# Altium schematic sheet Controller Mainboard.SchDoc
size D; SheetNumber: 1; SheetTotal: 1
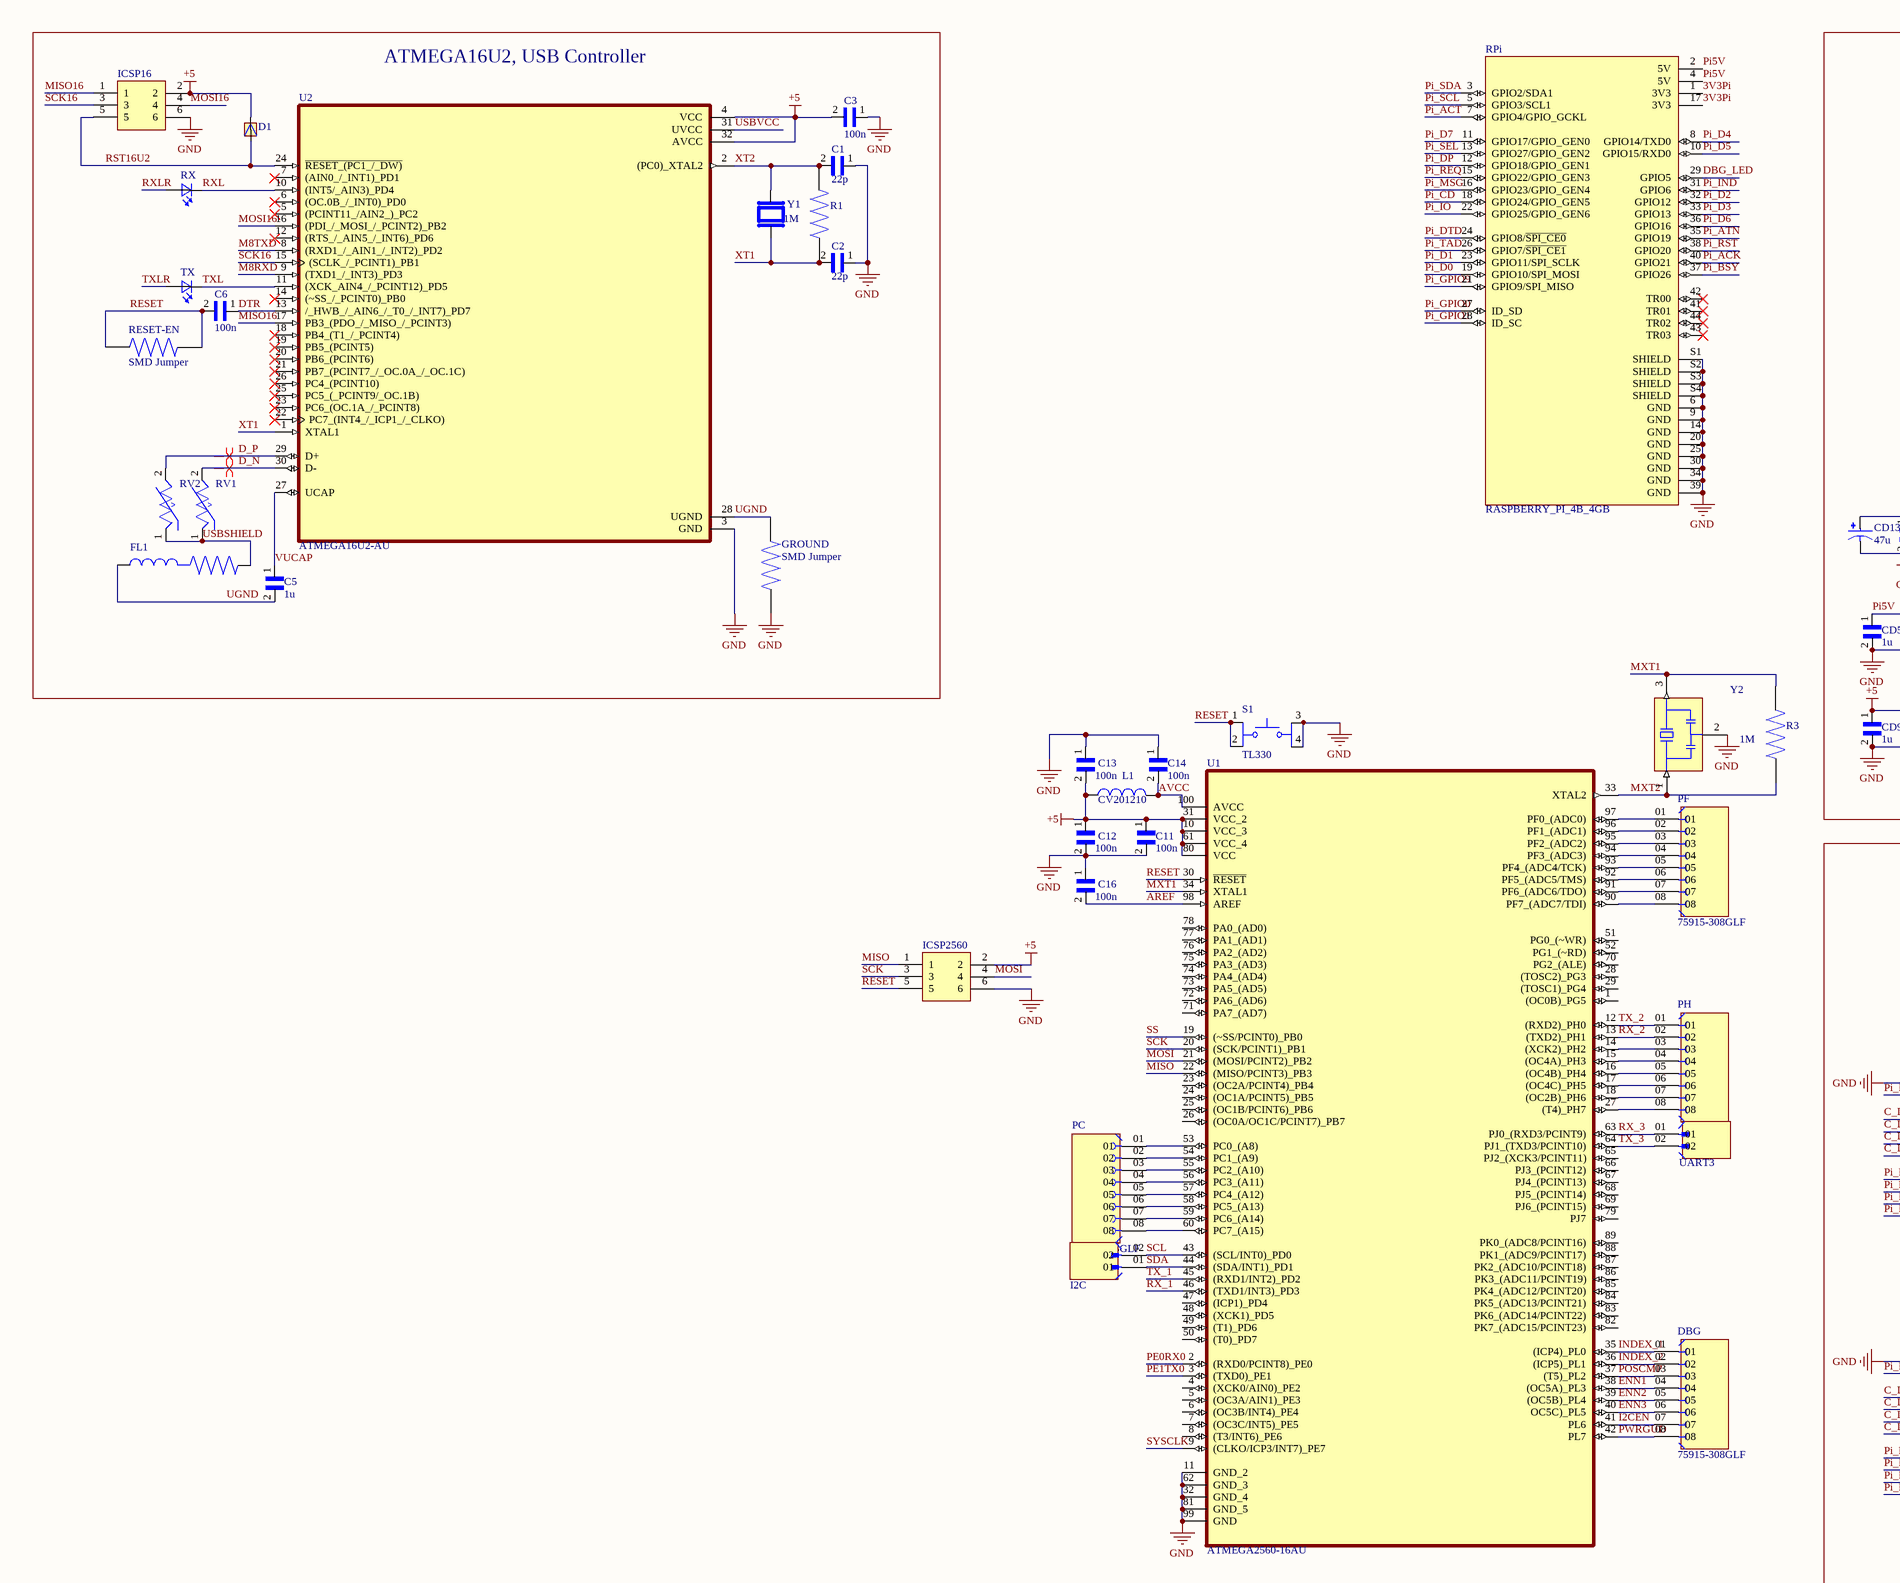
[diagram p0: Controller Mainboard.SchDoc, top left]
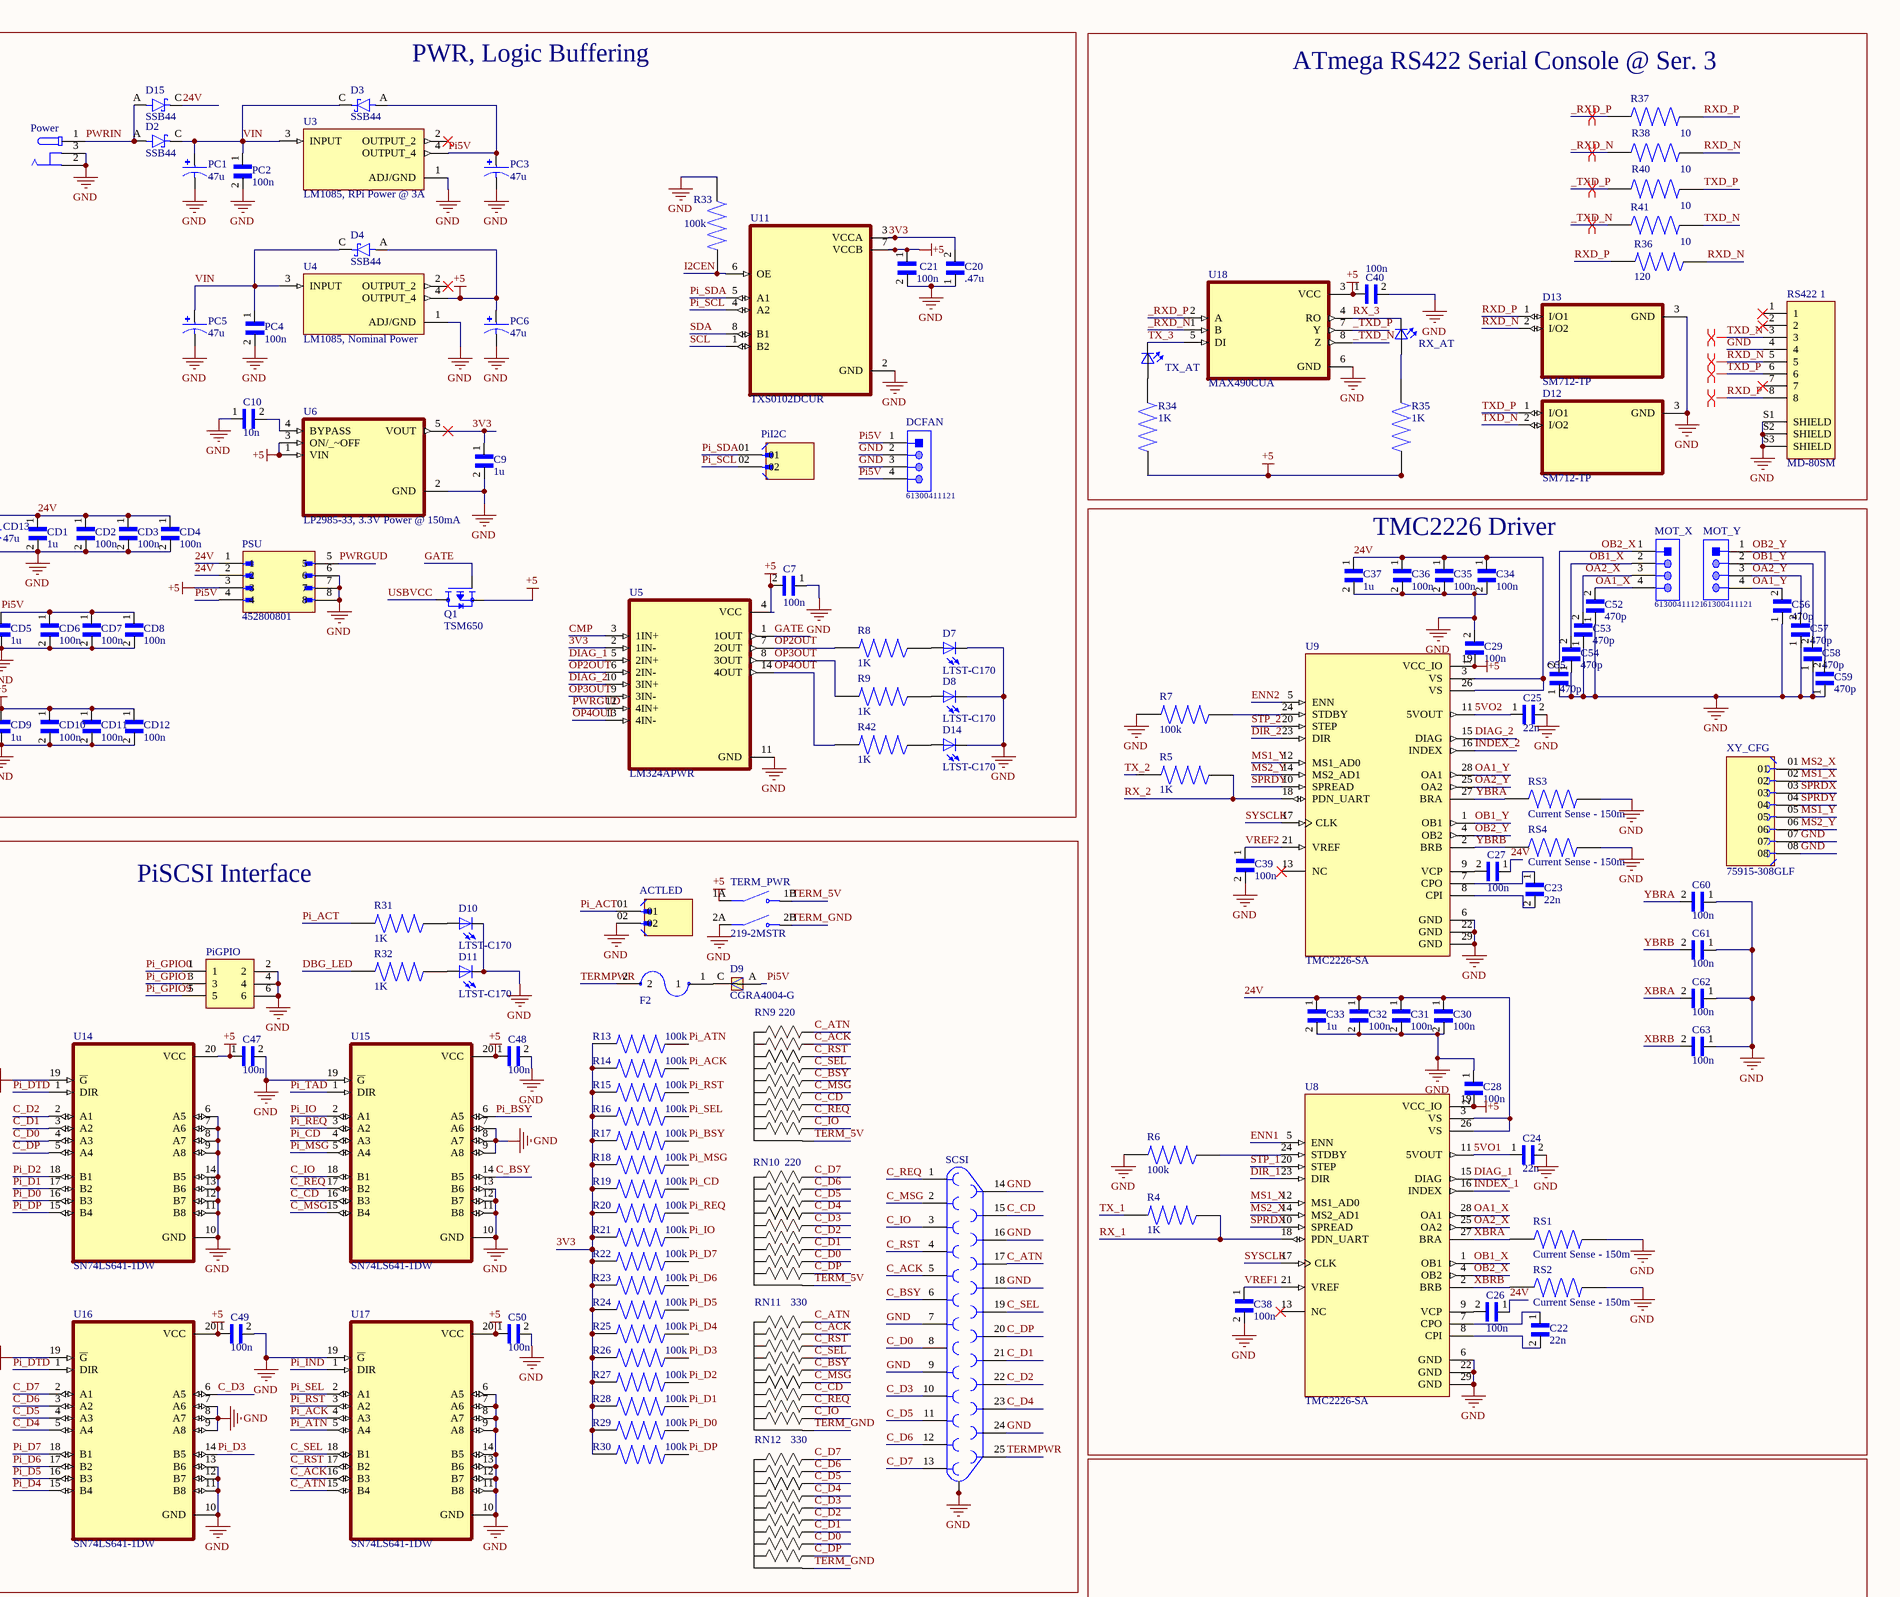
[diagram p1: Controller Mainboard.SchDoc, top right]
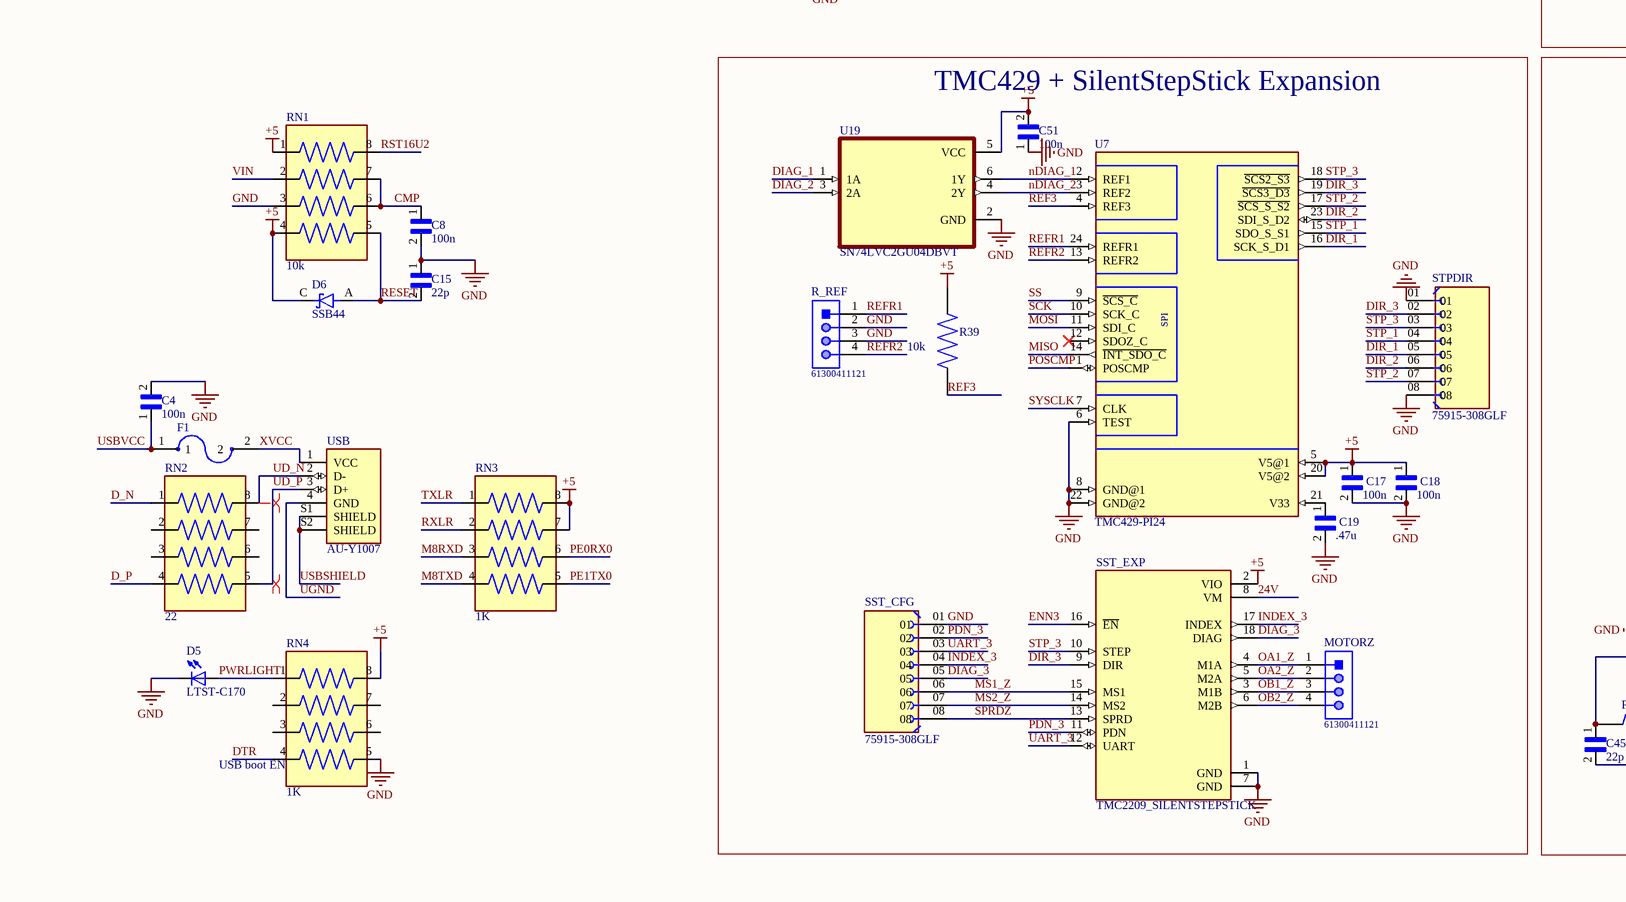
[diagram p2: Controller Mainboard.SchDoc, bottom left]
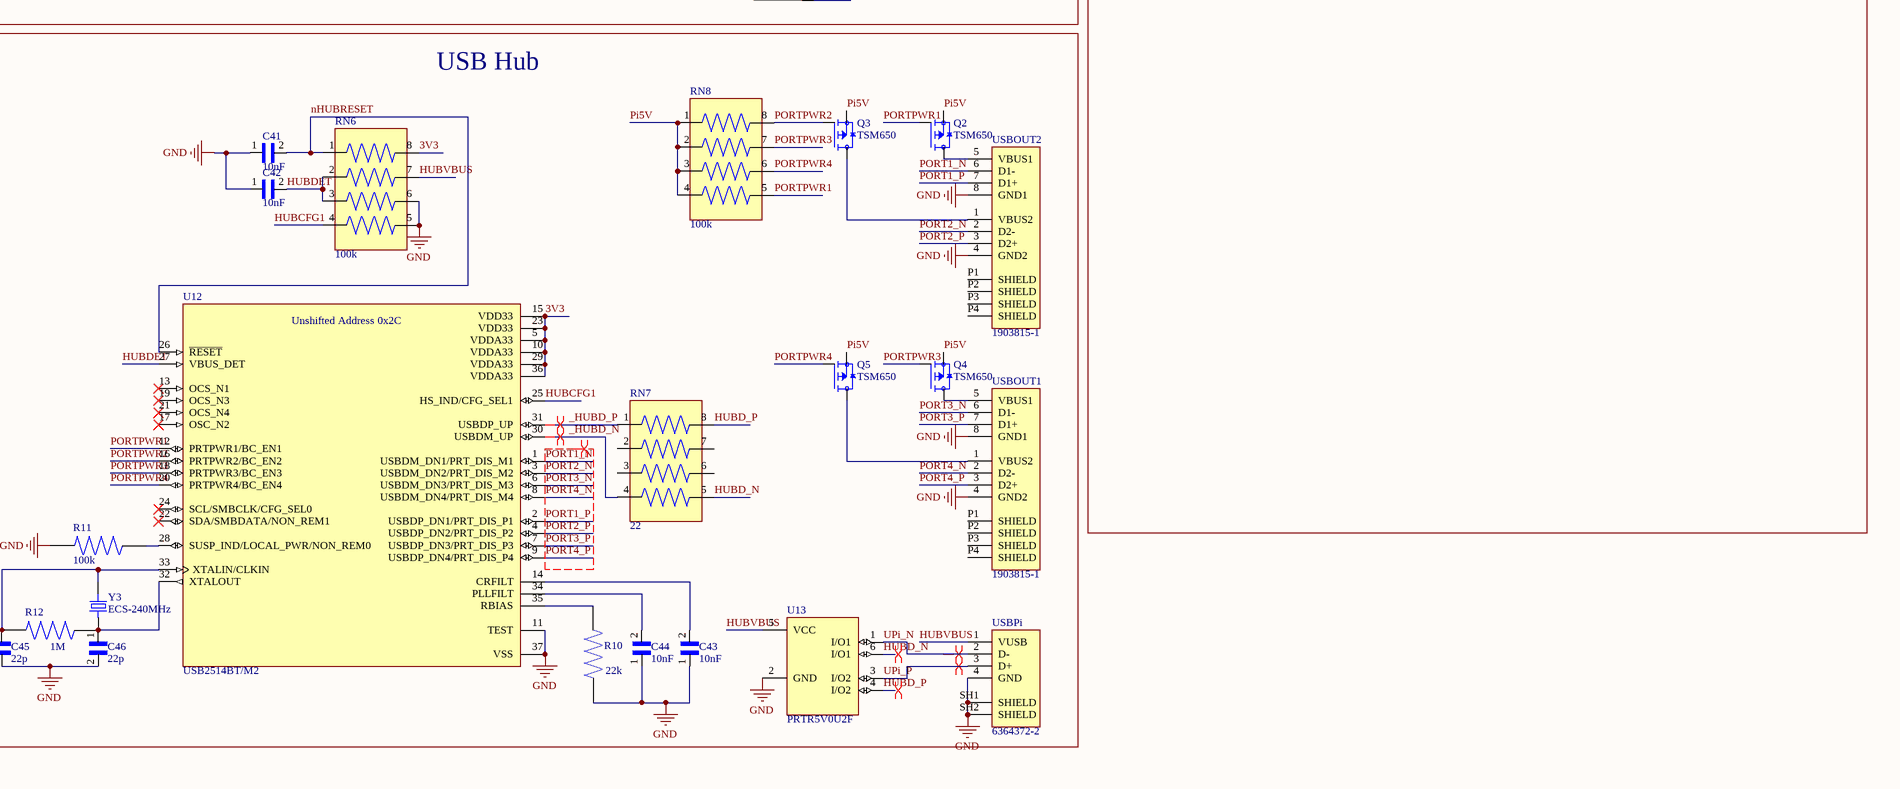
[diagram p3: Controller Mainboard.SchDoc, bottom right]

## Parts
ACTLED  77311-118-02LF  [AMPHENOL_77311-118-02LF]  (value not drawn)
C1  22p  [CAPC1608X90]
C2  22p  [CAPC1608X90]
C3  100n  [CAPC1608X90]
C4  100n  [CAPC1608X90]
C5  1u  [CAPC1608X90]
C6  100n  [CAPC1608X90]
C7  100n  [CAPC1608X90]
C8  100n  [CAPC1608X90]
C9  1u  [CAPC1608X90]
C10  10n  [CAPC1608X90]
C11  100n  [CAPC1608X90]
C12  100n  [CAPC1608X90]
C13  100n  [CAPC1608X90]
C14  100n  [CAPC1608X90]
C15  22p  [CAPC1608X90]
C16  100n  [CAPC1608X90]
C17  100n  [CAPC1608X90]
C18  100n  [CAPC1608X90]
C19  .47u  [CAPC1608X90]
C20  .47u  [CAPC1608X90]
C21  100n  [CAPC1608X90]
C22  22n  [CAPC1608X90]
C23  22n  [CAPC1608X90]
C24  22n  [CAPC1608X90]
C25  22n  [CAPC1608X90]
C26  100n  [CAPC1608X90]
C27  100n  [CAPC1608X90]
C28  100n  [CAPC1608X90]
C29  100n  [CAPC1608X90]
C30  100n  [CAPC1608X90]
C31  100n  [CAPC1608X90]
C32  100n  [CAPC1608X90]
C33  1u  [CAPC1608X90]
C34  100n  [CAPC1608X90]
C35  100n  [CAPC1608X90]
C36  100n  [CAPC1608X90]
C37  1u  [CAPC1608X90]
C38  100n  [CAPC1608X90]
C39  100n  [CAPC1608X90]
C40  100n  [CAPC1608X90]
C41  10nF  [CAPC1608X90]
C42  10nF  [CAPC1608X90]
C43  10nF  [CAPC1608X90]
C44  10nF  [CAPC1608X90]
C45  22p  [CAPC1608X90]
C46  22p  [CAPC1608X90]
C47  100n  [CAPC1608X90]
C48  100n  [CAPC1608X90]
C49  100n  [CAPC1608X90]
C50  100n  [CAPC1608X90]
C51  100n  [CAPC1608X90]
C52  470p  [CAPC1608X90]
C53  470p  [CAPC1608X90]
C54  470p  [CAPC1608X90]
C55  470p  [CAPC1608X90]
C56  470p  [CAPC1608X90]
C57  470p  [CAPC1608X90]
C58  470p  [CAPC1608X90]
C59  470p  [CAPC1608X90]
C60  100n  [CAPC1608X90]
C61  100n  [CAPC1608X90]
C62  100n  [CAPC1608X90]
C63  100n  [CAPC1608X90]
CD1  1u  [CAPC1608X90]
CD2  100n  [CAPC1608X90]
CD3  100n  [CAPC1608X90]
CD4  100n  [CAPC1608X90]
CD5  1u  [CAPC1608X90]
CD6  100n  [CAPC1608X90]
CD7  100n  [CAPC1608X90]
CD8  100n  [CAPC1608X90]
CD9  1u  [CAPC1608X90]
CD10  100n  [CAPC1608X90]
CD11  100n  [CAPC1608X90]
CD12  100n  [CAPC1608X90]
CD13  47u  [CAP_EEHZA1V470P]
D1  CD1206-S01575  [1206(DIODE)]  (value not drawn)
D2  SSB44  [DIOM5336X265N]
D3  SSB44  [DIOM5336X265N]
D4  SSB44  [DIOM5336X265N]
D5  LTST-C170  [DIOC200X125X110]
D6  SSB44  [DIOM5336X265N]
D7  LTST-C170  [DIOC200X125X110]
D8  LTST-C170  [DIOC200X125X110]
D9  CGRA4004-G  [DIOM5127X229N]
D10  LTST-C170  [DIOC200X125X110]
D11  LTST-C170  [DIOC200X125X110]
D12  SM712-TP  [SOT23-3P96_237X112L42X44]
D13  SM712-TP  [SOT23-3P96_237X112L42X44]
D14  LTST-C170  [DIOC200X125X110]
D15  SSB44  [DIOM5336X265N]
DBG  75915-308GLF  [AMPHENOL_75915-308GLF]
DCFAN  61300411121  [61300411121]
F1  MF-MSMF050-2  [FUSM4632X85]  (value not drawn)
F2  MF-MSMF050-2  [FUSM4632X85]  (value not drawn)
FL1  BLM21PG300SN1D  [BEADC2012X105N]  (value not drawn)
GROUND  SMD Jumper  [RESC1608X60N]
I2C  77311-118-02LF  [AMPHENOL_77311-118-02LF]  (value not drawn)
ICSP16  67997-206HLF  [FRAMATOME_67997-206HLF]  (value not drawn)
ICSP2560  67997-206HLF  [FRAMATOME_67997-206HLF]  (value not drawn)
L1  CV201210  [INDC2012X145N]
MOT_X  61300411121  [61300411121]
MOT_Y  61300411121  [61300411121]
MOTORZ  61300411121  [61300411121]
PC  75915-308GLF  [AMPHENOL_75915-308GLF]
PC1  47u  [CAP_EEHZA1V470P]
PC2  100n  [CAPC1608X90]
PC3  47u  [CAP_EEHZA1V470P]
PC4  100n  [CAPC1608X90]
PC5  47u  [CAP_EEHZA1V470P]
PC6  47u  [CAP_EEHZA1V470P]
PF  75915-308GLF  [AMPHENOL_75915-308GLF]
PH  75915-308GLF  [AMPHENOL_75915-308GLF]  (value not drawn)
PiGPIO  67997-206HLF  [FRAMATOME_67997-206HLF]  (value not drawn)
PiI2C  77311-118-02LF  [AMPHENOL_77311-118-02LF]  (value not drawn)
Power  EJ508A  [MPD_EJ508A]  (value not drawn)
PSU  452800801  [MOLEX_452800801]
Q1  TSM650  [TRANS_TSM650P02CX_RFG]
Q2  TSM650  [TRANS_TSM650P02CX_RFG]
Q3  TSM650  [TRANS_TSM650P02CX_RFG]
Q4  TSM650  [TRANS_TSM650P02CX_RFG]
Q5  TSM650  [TRANS_TSM650P02CX_RFG]
R1  1M  [RESC1608X55N]
R3  1M  [RESC1608X55N]
R4  1K  [RESC1608X55N]
R5  1K  [RESC1608X55N]
R6  100k  [RESC1608X55N]
R7  100k  [RESC1608X55N]
R8  1K  [RESC1608X55N]
R9  1K  [RESC1608X55N]
R10  22k  [RESC1608X55N]
R11  100k  [RESC1608X55N]
R12  1M  [RESC1608X55N]
R13  100k  [RESC1608X55N]
R14  100k  [RESC1608X55N]
R15  100k  [RESC1608X55N]
R16  100k  [RESC1608X55N]
R17  100k  [RESC1608X55N]
R18  100k  [RESC1608X55N]
R19  100k  [RESC1608X55N]
R20  100k  [RESC1608X55N]
R21  100k  [RESC1608X55N]
R22  100k  [RESC1608X55N]
R23  100k  [RESC1608X55N]
R24  100k  [RESC1608X55N]
R25  100k  [RESC1608X55N]
R26  100k  [RESC1608X55N]
R27  100k  [RESC1608X55N]
R28  100k  [RESC1608X55N]
R29  100k  [RESC1608X55N]
R30  100k  [RESC1608X55N]
R31  1K  [RESC1608X55N]
R32  1K  [RESC1608X55N]
R33  100k  [RESC1608X55N]
R34  1K  [RESC1608X55N]
R35  1K  [RESC1608X55N]
R36  120  [RESC1608X55N]
R37  10  [RESC1608X55N]
R38  10  [RESC1608X55N]
R39  10k  [RESC1608X55N]
R40  10  [RESC1608X55N]
R41  10  [RESC1608X55N]
R42  1K  [RESC1608X55N]
R_REF  61300411121  [61300411121]
RESET-EN  SMD Jumper  [RESC1608X60N]
RN1  10k  [RESCAF80P320X160X60-8N]
RN2  22  [RESCAF80P320X160X60-8N]
RN3  1K  [RESCAF80P320X160X60-8N]
RN4  1K  [RESCAF80P320X160X60-8N]
RN6  100k  [RESCAF80P320X160X60-8N]
RN7  22  [RESCAF80P320X160X60-8N]
RN8  100k  [RESCAF80P320X160X60-8N]
RN9  220  [10SIP Res Array]
RN10  220  [10SIP Res Array]
RN11  330  [10SIP Res Array]
RN12  330  [10SIP Res Array]
RPi  RASPBERRY_PI_4B_4GB  [MODULE_RASPBERRY_PI_4B_4GB]
RS1  Current Sense - 150m  [RESC6331X70N]
RS2  Current Sense - 150m  [RESC6331X70N]
RS3  Current Sense - 150m  [RESC6331X70N]
RS4  Current Sense - 150m  [RESC6331X70N]
RS422_1  MD-80SM  [CUI_MD-80SM]
RV1  CG0603MLC-05E  [VARC1608X56N]  (value not drawn)
RV2  CG0603MLC-05E  [VARC1608X56N]  (value not drawn)
RX  HSMA-C191  [0603]  (value not drawn)
RX_AT  HSMA-C191  [0603]  (value not drawn)
S1  TL330  [SW_TL3301NF260QG]
SCSI  10090099-S254VLF  [10090099-S254VLF]  (value not drawn)
SST_CFG  75915-308GLF  [AMPHENOL_75915-308GLF]
SST_EXP  TMC2209_SILENTSTEPSTICK  [MODULE_TMC2209_SILENTSTEPSTICK]
STPDIR  75915-308GLF  [AMPHENOL_75915-308GLF]
TERM_PWR  219-2MSTR  [SW_219-2MSTR]
TX  HSMA-C191  [0603]  (value not drawn)
TX_AT  HSMA-C191  [0603]  (value not drawn)
U1  ATMEGA2560-16AU  [QFP50P1600X1600X120-100N]
U2  ATMEGA16U2-AU  [QFP80P900X900X120-32N]
U3  LM1085, RPi Power @ 3A  [TO254P1435X464-4N]
U4  LM1085, Nominal Power  [TO254P1435X464-4N]
U5  LM324APWR  [SOP65P640X120-14N]
U6  LP2985-33, 3.3V Power @ 150mA  [SOT95P280X145-5N]
U7  TMC429-PI24  [SOP24]
U8  TMC2226-SA  [SOP65P640X120-29N]
U9  TMC2226-SA  [SOP65P640X120-29N]
U11  TXS0102DCUR  [SOP50P310X90-8N]
U12  USB2514BT/M2  [QFN50P600X600X100-37N]
U13  PRTR5V0U2F  [PSON50P145X100X90-6N]
U14  SN74LS641-1DW  [SOIC127P1030X265-20N]
U15  SN74LS641-1DW  [SOIC127P1030X265-20N]
U16  SN74LS641-1DW  [SOIC127P1030X265-20N]
U17  SN74LS641-1DW  [SOIC127P1030X265-20N]
U18  MAX490CUA  [SOP65P490X110-8N]
U19  SN74LVC2GU04DBVT  [SOT95P280X145-6N]
UART3  77311-118-02LF  [AMPHENOL_77311-118-02LF]  (value not drawn)
USB  AU-Y1007  [ASSMANN_AU-Y1007]
USBOUT1  1903815-1  [TE_1903815-1]
USBOUT2  1903815-1  [TE_1903815-1]
USBPi  6364372-2  [TE_6364372-2]
XY_CFG  75915-308GLF  [AMPHENOL_75915-308GLF]
Y1  ABLS-16.000MHZ-20-B-4-Y-T  [XTAL_ABLS-16.000MHZ-20-B-4-Y-T]  (value not drawn)
Y2  CSTNE16M0V530000R0  [OSC_CSTNE16M0V530000R0]  (value not drawn)
Y3  ECS-240MHz  [XTAL_ECS-240-18-5PXEN-TR]

## Blocks framed on the sheet
ATMEGA16U2, USB Controller: C1-C3 C5 C6 D1 FL1 GROUND ICSP16 R1 RESET-EN RV1 RV2 RX TX U2 Y1
PWR, Logic Buffering: C7 C9 C10 C20 C21 CD1-CD13 D2-D4 D7 D8 D14 D15 DCFAN PC1-PC6 PiI2C Power PSU Q1 R8 R9 R33 R42 U3-U6 U11
ATmega RS422 Serial Console @ Ser. 3: C40 D12 D13 R34-R38 R40 R41 RS422_1 RX_AT TX_AT U18
TMC2226 Driver: C22-C39 C52-C63 MOT_X MOT_Y R4-R7 RS1-RS4 U8 U9 XY_CFG
PiSCSI Interface: ACTLED C47-C50 D9-D11 F2 PiGPIO R13-R32 RN9-RN12 SCSI TERM_PWR U14-U17
TMC429 + SilentStepStick Expansion: C17-C19 C51 MOTORZ R39 R_REF SST_CFG SST_EXP STPDIR U7 U19
USB Hub: C41-C46 Q2-Q5 R10-R12 RN6-RN8 U12 U13 USBOUT1 USBOUT2 USBPi Y3

## Nets
+5: C3.2 C7.2 C11.1 C12.1 C13.2 C17.1 C18.1 C21.1 C28.2 C29.1 C40.1 C47.1 C48.1 C49.1 C50.1 C51.2 CD9.1 CD10.1 CD11.1 CD12.1 D1.C D4.A D6.C(K) ICSP16.2 ICSP2560.2 L1.1 PC6.1 PSU.3 Q1.2(S) R34.2 R35.2 R39.2 RN1.1 RN1.4 RN3.7 RN3.8 RN4.8 SST_EXP.2(VIO) TERM_PWR.1A(COM1) U1.10(VCC_3) U1.31(VCC_2) U1.61(VCC_4) U1.80(VCC) U2.4(VCC) U2.32(AVCC) U4.4(OUTPUT_4) U5.4(VCC) U6.1(VIN) U6.3(ON/_~OFF) U7.5(V5@1) U7.20(V5@2) U8.19(VCC_IO) U9.19(VCC_IO) U11.7(VCCB) U14.20(VCC) U15.20(VCC) U16.20(VCC) U17.20(VCC) U18.3(VCC) U19.5(VCC)
GND: ACTLED.02 C1.1 C2.1 C3.1 C4.2 C7.1 C8.2 C9.2 C10.1 C11.2 C12.2 C13.1 C14.1 C15.1 C16.1 C17.2 C18.2 C19.2 C20.1 C21.2 C24.2 C25.2 C28.1 C29.2 C30.2 C31.2 C32.2 C33.2 C34.2 C35.2 C36.2 C37.2 C38.2 C39.2 C40.2 C41.1 C42.1 C43.1 C44.1 C45.2 C46.2 C47.2 C48.2 C49.2 C50.2 C51.1 C52.1 C53.1 C54.1 C55.1 C56.1 C57.1 C58.1 C59.1 C60.1 C61.1 C62.1 C63.1 CD1.2 CD2.2 CD3.2 CD4.2 CD5.2 CD6.2 CD7.2 CD8.2 CD9.2 CD10.2 CD11.2 CD12.2 CD13.2 D5.NEG D7.NEG D8.NEG D10.NEG D11.NEG D12.3(GND) D13.3(GND) D14.NEG DCFAN.2 DCFAN.3 GROUND.2 ICSP16.6 ICSP2560.6 PC1.2 PC2.2 PC3.2 PC4.2 PC5.2 PC6.2 PiGPIO.2 PiGPIO.4 PiGPIO.6 Power.2 Power.3 PSU.6 PSU.7 PSU.8 R6.2 R7.2 R10.1 R11.2 R33.1 R_REF.2 R_REF.3 RN1.3 RN4.5 RN6.5 RN6.6 RPi.6(GND) RPi.9(GND) RPi.14(GND) RPi.20(GND) RPi.25(GND) RPi.30(GND) RPi.34(GND) RPi.39(GND) RPi.S1(SHIELD) RPi.S2(SHIELD) RPi.S3(SHIELD) RPi.S4(SHIELD) RS1.2 RS2.2 RS3.2 RS4.2 RS422_1.4 RS422_1.S1(SHIELD) RS422_1.S2(SHIELD) RS422_1.S3(SHIELD) S1.3 S1.4 SCSI.7 SCSI.9 SCSI.14 SCSI.16 SCSI.18 SCSI.24 SCSI.GND@1(GND) SCSI.GND@2(GND) SST_CFG.01 SST_EXP.1(GND) SST_EXP.7(GND) STPDIR.01 STPDIR.08 TERM_PWR.2A(COM2) U1.11(GND_2) U1.32(GND_4) U1.62(GND_3) U1.81(GND_5) U1.99(GND) U2.3(GND) U3.1(ADJ/GND) U4.1(ADJ/GND) U5.11(GND) U6.2(GND) U7.6(TEST) U7.8(GND@1) U7.22(GND@2) U8.6(GND) U8.22(GND) U8.29(GND) U9.6(GND) U9.22(GND) U9.29(GND) U11.2(GND) U12.11(TEST) U12.37(VSS) U13.2(GND) U14.6(A5) U14.7(A6) U14.8(A7) U14.9(A8) U14.10(GND) U14.11(B8) U14.12(B7) U14.13(B6) U14.14(B5) U14.19(~{G}) U15.7(A6) U15.8(A7) U15.9(A8) U15.10(GND) U15.11(B8) U15.12(B7) U15.13(B6) U15.19(~{G}) U16.7(A6) U16.8(A7) U16.9(A8) U16.10(GND) U16.11(B8) U16.12(B7) U16.13(B6) U16.19(~{G}) U17.6(A5) U17.7(A6) U17.8(A7) U17.9(A8) U17.10(GND) U17.11(B8) U17.12(B7) U17.13(B6) U17.14(B5) U17.19(~{G}) U18.6(GND) U19.2(GND) USBOUT1.4(GND2) USBOUT1.8(GND1) USBOUT2.4(GND2) USBOUT2.8(GND1) USBPi.4(GND) USBPi.SH1(SHIELD) USBPi.SH2(SHIELD) XY_CFG.07 XY_CFG.08 Y2.2(GND)
3V3: C9.1 C20.2 R13.2 R14.2 R15.2 R16.2 R17.2 R18.2 R19.2 R20.2 R21.2 R22.2 R23.2 R24.2 R25.2 R26.2 R27.2 R28.2 R29.2 R30.2 RN6.8 U5.2(1IN-) U6.5(VOUT) U11.3(VCCA) U12.5(VDDA33) U12.10(VDDA33) U12.15(VDD33) U12.23(VDD33) U12.29(VDDA33) U12.36(VDDA33)
3V3Pi: RPi.1(3V3) RPi.17(3V3)
5VO1: C24.1 U8.11(5VOUT)
5VO2: C25.1 U9.11(5VOUT)
24V: C26.1 C27.1 C30.1 C31.1 C32.1 C33.1 C34.1 C35.1 C36.1 C37.1 CD1.1 CD2.1 CD3.1 CD4.1 CD13.1 D15.C(K) PSU.1 PSU.2 SST_EXP.8(VM) U8.3(VS) U8.26(VS) U9.3(VS) U9.26(VS)
_HUBD_N: RN7.4 U12.30(USBDM_UP)
_HUBD_P: RN7.1 U12.31(USBDP_UP)
_RXD_N: R38.1 U18.1(B)
_RXD_P: R37.1 U18.2(A)
_TXD_N: R41.1 U18.8(Z)
_TXD_P: R40.1 U18.7(Y)
AREF: C16.2 U1.98(AREF)
AVCC: C14.2 L1.2 U1.100(AVCC)
C_ACK: RN9.9 RN11.9 SCSI.5 U17.16(B3)
C_ATN: RN9.10 RN11.10 SCSI.17 U17.15(B4)
C_BSY: RN9.6 RN11.6 SCSI.6 U15.14(B5)
C_CD: RN9.4 RN11.4 SCSI.15 U15.16(B3)
C_D0: RN10.3 RN12.3 SCSI.8 U14.4(A3)
C_D1: RN10.4 RN12.4 SCSI.21 U14.3(A2)
C_D2: RN10.5 RN12.5 SCSI.22 U14.2(A1)
C_D3: RN10.6 RN12.6 SCSI.10 U16.6(A5)
C_D4: RN10.7 RN12.7 SCSI.23 U16.5(A4)
C_D5: RN10.8 RN12.8 SCSI.11 U16.4(A3)
C_D6: RN10.9 RN12.9 SCSI.12 U16.3(A2)
C_D7: RN10.10 RN12.10 SCSI.13 U16.2(A1)
C_DP: RN10.2 RN12.2 SCSI.20 U14.5(A4)
C_IO: RN9.2 RN11.2 SCSI.3 U15.18(B1)
C_MSG: RN9.5 RN11.5 SCSI.2 U15.15(B4)
C_REQ: RN9.3 RN11.3 SCSI.1 U15.17(B2)
C_RST: RN9.8 RN11.8 SCSI.4 U17.17(B2)
C_SEL: RN9.7 RN11.7 SCSI.19 U17.18(B1)
CMP: C8.1 RN1.6 RN1.7 U5.3(1IN+)
D_N: RN2.1 RV1.2 U2.30(D-)
D_P: RN2.4 RV2.2 U2.29(D+)
DBG_LED: R32.2 RPi.29(GPIO5)
DIAG_1: U5.5(2IN+) U8.15(DIAG) U19.1(1A)
DIAG_2: U5.10(3IN+) U9.15(DIAG) U19.3(2A)
DIAG_3: SST_CFG.05 SST_EXP.18(DIAG)
DIR_1: STPDIR.05 U7.16(SCK_S_D1) U8.23(DIR)
DIR_2: STPDIR.06 U7.23(SDI_S_D2) U9.23(DIR)
DIR_3: SST_EXP.9(DIR) STPDIR.02 U7.19(~{SCS3_D3})
DTR: C6.1 RN4.4 U2.13(/_HWB_/_AIN6_/_T0_/_INT7)_PD7)
ENN1: DBG.04 U1.38((OC5A)_PL3) U8.5(ENN)
ENN2: DBG.05 U1.39((OC5B)_PL4) U9.5(ENN)
ENN3: DBG.06 SST_EXP.16(~{EN}) U1.40(OC5C)_PL5)
GATE: Q1.1(G) U5.1(1OUT)
HUBCFG1: RN6.4 U12.25(HS_IND/CFG_SEL1)
HUBD_N: RN7.5 U13.6(I/O1)
HUBD_P: RN7.8 U13.4(I/O2)
HUBDET: C42.2 RN6.2 RN6.3 U12.27(VBUS_DET)
HUBVBUS: RN6.7 U13.5(VCC) USBPi.1(VUSB)
I2CEN: DBG.07 R33.2 U1.41(PL6) U11.6(OE)
INDEX_1: DBG.01 U1.35((ICP4)_PL0) U8.16(INDEX)
INDEX_2: DBG.02 U1.36((ICP5)_PL1) U9.16(INDEX)
INDEX_3: SST_CFG.04 SST_EXP.17(INDEX)
M8RXD: RN3.3 U2.9((TXD1_/_INT3)_PD3)
M8TXD: RN3.4 U2.8((RXD1_/_AIN1_/_INT2)_PD2)
MISO: ICSP2560.1 U1.22((MISO/PCINT3)_PB3) U7.14(~{INT_SDO_C})
MISO16: ICSP16.1 U2.17(PB3_(PDO_/_MISO_/_PCINT3))
MOSI: ICSP2560.4 U1.21((MOSI/PCINT2)_PB2) U7.11(SDI_C)
MOSI16: ICSP16.4 U2.16((PDI_/_MOSI_/_PCINT2)_PB2)
MS1_X: U8.12(MS1_AD0) XY_CFG.02
MS1_Y: U9.12(MS1_AD0) XY_CFG.05
MS1_Z: SST_CFG.06 SST_EXP.15(MS1)
MS2_X: U8.14(MS2_AD1) XY_CFG.01
MS2_Y: U9.14(MS2_AD1) XY_CFG.06
MS2_Z: SST_CFG.07 SST_EXP.14(MS2)
MXT1: R3.2 U1.34(XTAL1) Y2.3(OUT)
MXT2: R3.1 U1.33(XTAL2) Y2.1(IN)
nDIAG_1: U7.2(REF1) U19.6(1Y)
nDIAG_2: U7.3(REF2) U19.4(2Y)
nHUBRESET: C41.2 RN6.1 U12.26(~{RESET})
OA1_X: C52.2 MOT_X.4 U8.28(OA1)
OA1_Y: C56.2 MOT_Y.4 U9.28(OA1)
OA1_Z: MOTORZ.1 SST_EXP.4(M1A)
OA2_X: C53.2 MOT_X.3 U8.25(OA2)
OA2_Y: C57.2 MOT_Y.3 U9.25(OA2)
OA2_Z: MOTORZ.2 SST_EXP.5(M2A)
OB1_X: C54.2 MOT_X.2 U8.1(OB1)
OB1_Y: C58.2 MOT_Y.2 U9.1(OB1)
OB1_Z: MOTORZ.3 SST_EXP.3(M1B)
OB2_X: C55.2 MOT_X.1 U8.4(OB2)
OB2_Y: C59.2 MOT_Y.1 U9.4(OB2)
OB2_Z: MOTORZ.4 SST_EXP.6(M2B)
OP2OUT: R8.2 U5.6(2IN-) U5.7(2OUT)
OP3OUT: R9.2 U5.8(3OUT) U5.9(3IN-)
OP4OUT: R42.2 U5.13(4IN-) U5.14(4OUT)
PDN_3: SST_CFG.02 SST_EXP.11(PDN)
PE0RX0: RN3.6 U1.2((RXD0/PCINT8)_PE0)
PE1TX0: RN3.5 U1.3((TXD0)_PE1)
Pi5V: CD5.1 CD6.1 CD7.1 CD8.1 D3.A D9.A DCFAN.1 DCFAN.4 PC3.1 PSU.4 Q2.2(S) Q3.2(S) Q4.2(S) Q5.2(S) RN8.1 RN8.2 RN8.3 RN8.4 RPi.2(5V) RPi.4(5V) U3.4(OUTPUT_4)
Pi_ACK: R14.1 RPi.40(GPIO21) U17.4(A3)
Pi_ACT: ACTLED.01 R31.2 RPi.7(GPIO4/GPIO_GCKL)
Pi_ATN: R13.1 RPi.35(GPIO19) U17.5(A4)
Pi_BSY: R17.1 RPi.37(GPIO26) U15.6(A5)
Pi_CD: R19.1 RPi.18(GPIO24/GPIO_GEN5) U15.4(A3)
Pi_D0: R29.1 RPi.19(GPIO10/SPI_MOSI) U14.16(B3)
Pi_D1: R28.1 RPi.23(GPIO11/SPI_SCLK) U14.17(B2)
Pi_D2: R27.1 RPi.32(GPIO12) U14.18(B1)
Pi_D3: R26.1 RPi.33(GPIO13) U16.14(B5)
Pi_D4: R25.1 RPi.8(GPIO14/TXD0) U16.15(B4)
Pi_D5: R24.1 RPi.10(GPIO15/RXD0) U16.16(B3)
Pi_D6: R23.1 RPi.36(GPIO16) U16.17(B2)
Pi_D7: R22.1 RPi.11(GPIO17/GPIO_GEN0) U16.18(B1)
Pi_DP: R30.1 RPi.12(GPIO18/GPIO_GEN1) U14.15(B4)
Pi_DTD: RPi.24(GPIO8/~{SPI_CE0}) U14.1(DIR) U16.1(DIR)
Pi_GPIO0: PiGPIO.1 RPi.27(ID_SD)
Pi_GPIO1: PiGPIO.3 RPi.28(ID_SC)
Pi_GPIO9: PiGPIO.5 RPi.21(GPIO9/SPI_MISO)
Pi_IND: RPi.31(GPIO6) U17.1(DIR)
Pi_IO: R21.1 RPi.22(GPIO25/GPIO_GEN6) U15.2(A1)
Pi_MSG: R18.1 RPi.16(GPIO23/GPIO_GEN4) U15.5(A4)
Pi_REQ: R20.1 RPi.15(GPIO22/GPIO_GEN3) U15.3(A2)
Pi_RST: R15.1 RPi.38(GPIO20) U17.3(A2)
Pi_SCL: PiI2C.02 RPi.5(GPIO3/SCL1) U11.4(A2)
Pi_SDA: PiI2C.01 RPi.3(GPIO2/SDA1) U11.5(A1)
Pi_SEL: R16.1 RPi.13(GPIO27/GPIO_GEN2) U17.2(A1)
Pi_TAD: RPi.26(GPIO7/~{SPI_CE1}) U15.1(DIR)
PORT1_N: U12.1(USBDM_DN1/PRT_DIS_M1) USBOUT2.6(D1-)
PORT1_P: U12.2(USBDP_DN1/PRT_DIS_P1) USBOUT2.7(D1+)
PORT2_N: U12.3(USBDM_DN2/PRT_DIS_M2) USBOUT2.2(D2-)
PORT2_P: U12.4(USBDP_DN2/PRT_DIS_P2) USBOUT2.3(D2+)
PORT3_N: U12.6(USBDM_DN3/PRT_DIS_M3) USBOUT1.6(D1-)
PORT3_P: U12.7(USBDP_DN3/PRT_DIS_P3) USBOUT1.7(D1+)
PORT4_N: U12.8(USBDM_DN4/PRT_DIS_M4) USBOUT1.2(D2-)
PORT4_P: U12.9(USBDP_DN4/PRT_DIS_P4) USBOUT1.3(D2+)
PORTPWR1: Q2.1(G) RN8.5 U12.12(PRTPWR1/BC_EN1)
PORTPWR2: Q3.1(G) RN8.8 U12.16(PRTPWR2/BC_EN2)
PORTPWR3: Q4.1(G) RN8.7 U12.18(PRTPWR3/BC_EN3)
PORTPWR4: Q5.1(G) RN8.6 U12.20(PRTPWR4/BC_EN4)
POSCMP: DBG.03 U1.37((T5)_PL2) U7.1(POSCMP)
PWRGUD: DBG.08 PSU.5 U1.42(PL7) U5.12(4IN+)
PWRIN: D2.A D15.A Power.1
PWRLIGHT: D5.POS RN4.1
REF3: R39.1 U7.4(REF3)
REFR1: R_REF.1 U7.24(REFR1)
REFR2: R_REF.4 U7.13(REFR2)
RESET: C6.2 C15.2 D6.A ICSP2560.5 RESET-EN.1 RESET-EN.2 RN1.5 S1.1 S1.2 U1.30(~{RESET})
RST16U2: D1.A ICSP16.5 RN1.8 U2.24(~{RESET_(PC1_/_DW)})
RX_1: R4.1 U1.46((TXD1/INT3)_PD3) U8.18(PDN_UART)
RX_2: PH.02 R5.1 U1.13((TXD2)_PH1) U9.18(PDN_UART)
RX_3: RX_AT.1(K2) U1.63(PJ0_(RXD3/PCINT9)) U18.4(RO) UART3.01
RXD_N: D13.2(I/O2) R36.1 R38.2 RS422_1.5
RXD_P: D13.1(I/O1) R36.2 R37.2 RS422_1.8
RXL: RX.1(K2) U2.10((INT5/_AIN3)_PD4)
RXLR: RN3.2 RX.2(A2)
SCK: ICSP2560.3 U1.20((SCK/PCINT1)_PB1) U7.10(SCK_C)
SCK16: ICSP16.3 U2.15((SCLK_/_PCINT1)_PB1)
SCL: I2C.02 U1.43((SCL/INT0)_PD0) U11.1(B2)
SDA: I2C.01 U1.44((SDA/INT1)_PD1) U11.8(B1)
SPRDX: U8.10(SPREAD) XY_CFG.03
SPRDY: U9.10(SPREAD) XY_CFG.04
SPRDZ: SST_CFG.08 SST_EXP.13(SPRD)
SS: U1.19((~SS/PCINT0)_PB0) U7.9(~{SCS_C})
STP_1: STPDIR.04 U7.15(SDO_S_S1) U8.20(STEP)
STP_2: STPDIR.07 U7.17(~{SCS_S_S2}) U9.20(STEP)
STP_3: SST_EXP.10(STEP) STPDIR.03 U7.18(~{SCS2_S3})
SYSCLK: U1.9((CLKO/ICP3/INT7)_PE7) U7.7(CLK) U8.17(CLK) U9.17(CLK)
TERM_5V: RN9.1 RN10.1 TERM_PWR.1B(NO1)
TERM_GND: RN11.1 RN12.1 TERM_PWR.2B(NO2)
TERMPWR: F2.2 SCSI.25
TX_1: R4.2 U1.45((RXD1/INT2)_PD2)
TX_2: PH.01 R5.2 U1.12((RXD2)_PH0)
TX_3: TX_AT.1(K2) U1.64(PJ1_(TXD3/PCINT10)) U18.5(DI) UART3.02
TXD_N: D12.2(I/O2) R41.2 RS422_1.3
TXD_P: D12.1(I/O1) R40.2 RS422_1.6
TXL: TX.1(K2) U2.11((XCK_AIN4_/_PCINT12)_PD5)
TXLR: RN3.1 TX.2(A2)
UART_3: SST_CFG.03 SST_EXP.12(UART)
UD_N: RN2.8 USB.2(D-)
UD_P: RN2.5 USB.3(D+)
UGND: C5.2 FL1.1 GROUND.1 U2.28(UGND) USB.4(GND)
UPi_N: U13.1(I/O1) USBPi.2(D-)
UPi_P: U13.3(I/O2) USBPi.3(D+)
USBSHIELD: FL1.2 RV1.1 RV2.1 USB.S1(SHIELD) USB.S2(SHIELD)
USBVCC: C4.1 F1.1 Q1.3(D) U2.31(UVCC)
VIN: D2.C(K) D3.C(K) D4.C(K) PC1.1 PC2.1 PC4.1 PC5.1 RN1.2 U3.3(INPUT) U4.3(INPUT)
VREF1: C38.1 U8.21(VREF)
VREF2: C39.1 U9.21(VREF)
VUCAP: C5.1 U2.27(UCAP)
XBRA: C62.2 RS1.1 U8.27(BRA)
XBRB: C63.2 RS2.1 U8.2(BRB)
XT1: C2.2 R1.1 U2.1(XTAL1) Y1.1
XT2: C1.2 R1.2 U2.2((PC0)_XTAL2) Y1.2
XVCC: F1.2 USB.1(VCC)
YBRA: C60.2 RS3.1 U9.27(BRA)
YBRB: C61.2 RS4.1 U9.2(BRB)
NetC10_2: C10.2 U6.4(BYPASS)
NetC19_1: C19.1 U7.21(V33)
NetC22_1: C22.1 U8.7(CPO)
NetC22_2: C22.2 U8.8(CPI)
NetC23_1: C23.1 U9.7(CPO)
NetC23_2: C23.2 U9.8(CPI)
NetC26_2: C26.2 U8.9(VCP)
NetC27_2: C27.2 U9.9(VCP)
NetC43_2: C43.2 U12.14(CRFILT)
NetC44_2: C44.2 U12.34(PLLFILT)
NetC45_1: C45.1 R12.2 U12.33(XTALIN/CLKIN) Y3.2
NetC46_1: C46.1 R12.1 U12.32(XTALOUT) Y3.1
NetD7_POS: D7.POS R8.1
NetD8_POS: D8.POS R9.1
NetD9_C: D9.C F2.1
NetD10_POS: D10.POS R31.1
NetD11_POS: D11.POS R32.1
NetD14_POS: D14.POS R42.1
NetPC_01: PC.01 U1.53(PC0_(A8))
NetPC_02: PC.02 U1.54(PC1_(A9))
NetPC_03: PC.03 U1.55(PC2_(A10))
NetPC_04: PC.04 U1.56(PC3_(A11))
NetPC_05: PC.05 U1.57(PC4_(A12))
NetPC_06: PC.06 U1.58(PC5_(A13))
NetPC_07: PC.07 U1.59(PC6_(A14))
NetPC_08: PC.08 U1.60(PC7_(A15))
NetPF_01: PF.01 U1.97(PF0_(ADC0))
NetPF_02: PF.02 U1.96(PF1_(ADC1))
NetPF_03: PF.03 U1.95(PF2_(ADC2))
NetPF_04: PF.04 U1.94(PF3_(ADC3))
NetPF_05: PF.05 U1.93(PF4_(ADC4/TCK))
NetPF_06: PF.06 U1.92(PF5_(ADC5/TMS))
NetPF_07: PF.07 U1.91(PF6_(ADC6/TDO))
NetPF_08: PF.08 U1.90(PF7_(ADC7/TDI))
NetPH_03: PH.03 U1.14((XCK2)_PH2)
NetPH_04: PH.04 U1.15((OC4A)_PH3)
NetPH_05: PH.05 U1.16((OC4B)_PH4)
NetPH_06: PH.06 U1.17((OC4C)_PH5)
NetPH_07: PH.07 U1.18((OC2B)_PH6)
NetPH_08: PH.08 U1.27((T4)_PH7)
NetQ2_3: Q2.3(D) USBOUT2.5(VBUS1)
NetQ3_3: Q3.3(D) USBOUT2.1(VBUS2)
NetQ4_3: Q4.3(D) USBOUT1.5(VBUS1)
NetQ5_3: Q5.3(D) USBOUT1.1(VBUS2)
NetR6_1: R6.1 U8.24(STDBY)
NetR7_1: R7.1 U9.24(STDBY)
NetR10_2: R10.2 U12.35(RBIAS)
NetR11_1: R11.1 U12.28(SUSP_IND/LOCAL_PWR/NON_REM0)
NetR34_1: R34.1 TX_AT.2(A2)
NetR35_1: R35.1 RX_AT.2(A2)

Not connected (* = marked no-connect by the designer): RN2 2 3 6 7; RN4 2 3 6 7; RN7 2 3 6 7; RPi 41(TR01)* 42(TR00)* 43(TR03)* 44(TR02)*; RS422_1 1* 2* 7*; U1 1((OC0B)_PG5) 4((XCK0/AIN0)_PE2) 5((OC3A/AIN1)_PE3) 6((OC3B/INT4)_PE4) 7((OC3C/INT5)_PE5) 8((T3/INT6)_PE6) 23((OC2A/PCINT4)_PB4) 24((OC1A/PCINT5)_PB5) 25((OC1B/PCINT6)_PB6) 26((OC0A/OC1C/PCINT7)_PB7) 28((TOSC2)_PG3) 29((TOSC1)_PG4) 47((ICP1)_PD4) 48((XCK1)_PD5) 49((T1)_PD6) 50((T0)_PD7) 51(PG0_(~WR)) 52(PG1_(~RD)) 65(PJ2_(XCK3/PCINT11)) 66(PJ3_(PCINT12)) 67(PJ4_(PCINT13)) 68(PJ5_(PCINT14)) 69(PJ6_(PCINT15)) 70(PG2_(ALE)) 71(PA7_(AD7)) 72(PA6_(AD6)) 73(PA5_(AD5)) 74(PA4_(AD4)) 75(PA3_(AD3)) 76(PA2_(AD2)) 77(PA1_(AD1)) 78(PA0_(AD0)) 79(PJ7) 82(PK7_(ADC15/PCINT23)) 83(PK6_(ADC14/PCINT22)) 84(PK5_(ADC13/PCINT21)) 85(PK4_(ADC12/PCINT20)) 86(PK3_(ADC11/PCINT19)) 87(PK2_(ADC10/PCINT18)) 88(PK1_(ADC9/PCINT17)) 89(PK0_(ADC8/PCINT16)); U2 5((PCINT11_/AIN2_)_PC2)* 6((OC.0B_/_INT0)_PD0)* 7((AIN0_/_INT1)_PD1)* 12((RTS_/_AIN5_/_INT6)_PD6)* 14((~SS_/_PCINT0)_PB0)* 18(PB4_(T1_/_PCINT4))* 19(PB5_(PCINT5))* 20(PB6_(PCINT6))* 21(PB7_(PCINT7_/_OC.0A_/_OC.1C))* 22(PC7_(INT4_/_ICP1_/_CLKO))* 23(PC6_(OC.1A_/_PCINT8))* 25(PC5_(_PCINT9/_OC.1B))* 26(PC4_(PCINT10))*; U3 2(OUTPUT_2)*; U4 2(OUTPUT_2)*; U7 12(SDOZ_C)*; U8 13(NC)*; U9 13(NC)*; U12 13(OCS_N1)* 17(OSC_N2)* 19(OCS_N3)* 21(OCS_N4)* 22(SDA/SMBDATA/NON_REM1)* 24(SCL/SMBCLK/CFG_SEL0)*; USBOUT1 P1(SHIELD) P2(SHIELD) P3(SHIELD) P4(SHIELD); USBOUT2 P1(SHIELD) P2(SHIELD) P3(SHIELD) P4(SHIELD)

## Layout directives
differential pair; differential pair class ProgUSB: UD_N, UD_P
differential pair; differential pair class 16U2USB: D_N, D_P
differential pair: _HUBD_N, _HUBD_P, _RXD_N, _RXD_P, _TXD_N, _TXD_P, HUBD_N, HUBD_P, PORT1_N, PORT1_P, PORT2_N, PORT2_P, PORT3_N, PORT3_P, PORT4_N, PORT4_P, RXD_N, RXD_P, TXD_N, TXD_P, UPi_N, UPi_P

## Notes on the sheet
- (near U12) Unshifted Address 0x2C
- (near RN4) USB boot EN
- (in symbol TMC429-PI24) SPI

## Library data of the parts
ACTLED I2C PiI2C UART3 = 77311-118-02LF: MF: {'manufacturer': u'Amphenol ICC'}; Value: *; Package: None; MP: 77311-118-02LF; Price: None; Availability: Unavailable
C1-C63 CD1-CD12 PC2 PC4 = LD034C222KAB2A: Cap Ceramic 0.0022uF 4V X7R 10% SMD 0603 125Â°C T/R; MF: {'manufacturer': u'AVX'}; MP: LD034C222KAB2A; Price: None; Package: None; Value: *; Availability: Unavailable
CD13 PC1 PC3 PC5 PC6 = EEHZA1V470P: MF: {'manufacturer': u'Panasonic Electronic'}; Price: None; Package: None; Availability: Unavailable; MP: EEHZA1V470P; Value: *
D1 = CD1206-S01575: Diode, Io=150mA, Vr=75V; MF: {'manufacturer': u'Bourns'}; Availability: Unavailable; Package: None; Price: None; MP: CD1206-S01575; Value: *
D2-D4 D6 D15 = SS24: Diode Schottky 40V 2A Surface Mount DO-214AA (SMB); MF: {'manufacturer': u'ON Semiconductor'}; Price: None; MP: SS24; Availability: Unavailable; Value: *; Package: None
D5 D7 D8 D10 D11 D14 = LTST-C170KGKT: Green 2 x 1.25 x 1.1 mm 130Â° Water Clear 35 mcd 2 V Surface Mount LED; MF: {'manufacturer': u'Lite-On Inc.'}; Value: *; MP: LTST-C170KGKT; Availability: Unavailable; Package: None; Price: None
D9 = CGRA4004-G: Comchip Cgra4004-g / Diode Gen Purpose 400v 1a Sma Comchip; MF: {'manufacturer': u'Comchip Technology'}; Availability: Unavailable; Price: None; Value: *; MP: CGRA4004-G; Package: None
D12 D13 = SM712-TP: MF: {'manufacturer': u'Micro Commercial'}; Availability: Unavailable; Price: None; Value: *; MP: SM712-TP; Package: None
DBG PC PF PH SST_CFG STPDIR XY_CFG = 75915-308GLF: MF: {'manufacturer': u'Amphenol ICC (FCI)'}; Availability: Unavailable; Package: None; MP: 75915-308GLF; Price: None; Value: *
DCFAN MOT_X MOT_Y MOTORZ R_REF = CMP-1502-01064-1: THT Vertical Pin Header WR-PHD, Pitch 2.54 mm, Single Row, 4 pins; Manufacturer: Wurth Elektronik; Withstanding Voltage: 500VAC; Rated Current: 3A; Working Voltage: 250VAC; Pin Number: 4; Gender: Male; Contact Resistance: 20mOhm; Pitch: 2.54mm; Manufacturer URL: http://www.we-online.de; Operating Temperature: -40to105degC; Packaging: Bag; Mounting Technology: THT; Package Reference: 61300411121; Datasheet URL: https://katalog.we-online.de/em/datasheet/6130xx11121.pdf; Publisher: WurthElektronik; Part Number: 61300411121; Row Number: Single; Orientation: Vertical
F1 F2 = MF-MSMF050-2: PTC Resettable Fuse 0.5A(hold) 1A(trip) 15V 100A 0.8W 0.15s 0.15Ohm SMD Solder Pad 1812 T/R; MF: {'manufacturer': u'Bourns'}; MP: MF-MSMF050-2; Availability: Unavailable; Value: *; Price: None; Package: None
FL1 = BLM21PG300SN1D: Ferrite Beads Multi-Layer 30Ohm 100MHz 4A 14mOhm DCR 0805 T/R; MF: {'manufacturer': u'Murata'}; Price: None; MP: BLM21PG300SN1D; Package: None; Value: *; Availability: Unavailable
GROUND RESET-EN = PA0603-R-070RL: MF: {'manufacturer': u'Yageo'}; Price: None; Package: None; Availability: Unavailable; MP: PA0603-R-070RL; Value: *
ICSP16 ICSP2560 PiGPIO = 67997-206HLF: Conn; Rect; UnshroudedHdr; 6Cnts; ThruHole; BergStik; 2.54mmPin-Spng; Vert; DblRow; MF: {'manufacturer': u'Amphenol ICC'}; Availability: Unavailable; Package: None; Price: None; MP: 67997-206HLF; Value: *
L1 = CV201210-100K: Ind Chip Shielded Multi-Layer 10uH 10% 2MHz 45Q-Factor Ferrite 15mA 2.0 x 1.2 mm T/R; MF: {'manufacturer': u'Bourns'}; Value: *; MP: CV201210-100K; Package: None; Price: None; Availability: Unavailable
Power = EJ508A: DC JACK - PCB MOUNTING 2.1 ID X 5.5 OD; MF: {'manufacturer': u'MPD (Memory Protection Devices)'}; Availability: Unavailable; Value: *; Price: None; Package: None; MP: EJ508A
PSU = 452800801: MF: {'manufacturer': u'Molex'}; Availability: Unavailable; Value: *; Price: None; Package: None; MP: 452800801
Q1-Q5 = TSM650P02CX_RFG: MF: {'manufacturer': u'Taiwan Semiconductor Corporation'}; Price: None; Availability: Unavailable; Package: None; MP: TSM650P02CX_RFG; Value: *
R1 R3-R42 = CRCW06031M00JNEAC: MF: {'manufacturer': u'Vishay'}; MP: CRCW06031M00JNEAC; Price: None; Package: None; Availability: Unavailable; Value: *
RN1 RN2 RN6-RN8 = CAY16-220J4LF: Res Thick Film Array 75 Ohm 5% 0.25W(1/4W) ?200ppm/C ISOL Molded 8-Pin 1206(4 X 0603) Convex SMD T/R; MF: {'manufacturer': u'Bourns'}; MP: CAY16-220J4LF; Price: None; Package: None; Value: *; Availability: Unavailable
RN3 RN4 = CAY16-102J4LF: Res Thick Film Array 75 Ohm 5% 0.25W(1/4W) ?200ppm/C ISOL Molded 8-Pin 1206(4 X 0603) Convex SMD T/R; MF: {'manufacturer': u'Bourns'}; Value: *; Package: None; MP: CAY16-102J4LF; Price: None; Availability: Unavailable
RN9-RN12 = 10SIP Res Array
RPi = RASPBERRY_PI_4B_4GB: MF: {'manufacturer': u'Raspberry Pi'}; Price: None; Availability: Unavailable; MP: RASPBERRY_PI_4B_4GB; Value: *; Package: None
RS1-RS4 = CSRN2512FKR150: MF: {'manufacturer': u'Stackpole Electronics Inc'}; Price: None; Value: *; Availability: Unavailable; MP: CSRN2512FKR150; Package: None
RS422_1 = MD-80SM: MF: {'manufacturer': u'CUI Devices'}; Value: *; Package: None; MP: MD-80SM; Price: None; Availability: Unavailable
RV1 RV2 = CG0603MLC-05E: Varistor 1 Circuit Surface Mount, MLCV 0603 (1608 Metric); MF: {'manufacturer': u'Bourns'}; Availability: Unavailable; Value: *; Price: None; Package: None; MP: CG0603MLC-05E
RX RX_AT TX TX_AT = HSMA-C191: http://octopart.com/hsma-c190-avago-550878; MF: {'manufacturer': u'Broadcom Limited'}; Value: *; Package: None; MP: HSMA-C191; Price: None; Availability: Unavailable
S1 = TL3301NF260QG: MF: {'manufacturer': u'E-Switch'}; Price: None; MP: TL3301NF260QG; Availability: Unavailable; Value: *; Package: None
SCSI = 10090099-S254VLF: <b>FCI 10090099-S254[VLX]LF DB-25 female connector, right angle PCB mount</b>; MF: {'manufacturer': u'Amphenol ICC'}; Value: *; Package: None; MP: 10090099-S254VLF; Price: None; Availability: Unavailable
SST_EXP = TMC2209_SILENTSTEPSTICK: MF: {'manufacturer': u'Trinamic Motion Control GmbH'}; Price: None; Availability: Unavailable; MP: TMC2209_SILENTSTEPSTICK; Package: None; Value: *
TERM_PWR = 219-2MSTR: Dip Switch SPST 2 Position Surface Mount Slide (Standard) Actuator 100mA 20VDC; MF: {'manufacturer': u'CTS CORP'}; Package: None; Value: *; Availability: Unavailable; MP: 219-2MSTR; Price: None
U1 = ATMEGA2560-16AU: <p><b>ARM Cortex M0 microcontroller</b></p> <p><b>EEPROM memory capacity:</b>	4kB</p> <p><b>SRAM memory capacity:</b>	32kB</p>	 <p><b>Flash memory capacity:</b>	256kB</p>	 	 <p><b>Package:</b>	TQFP100	</p> <p><b>Number of PWM channels:</b>	15</p> <p><b>Number of 8bit timers:</b>	2</p>	 <p><b>Number of 16bit timers:</b>	5</p>	 <p><b>Mounting:</b>	SMD</p>	  <p><b>Operating temperature:</b>	-40...85Â°C</p> <p><b>Supplier name:</b> TME</p> <p><b>Link:</b> <a href="https://www.tme.eu/cz/details/atmega2560-16au/rodina-avr-8-bitu/microchip-atmel/">https://https://www.tme.eu/cz/details/atmega2560-16au/rodina-avr-8-bitu/microchip-atmel/</a></p>; MF: {'manufacturer': u'Microchip'}; MP: ATMEGA2560-16AU; Price: None; Package: None; Availability: Unavailable; Value: *
U2 = ATMEGA16U2-AU: MF: {'manufacturer': u'Microchip'}; MP: ATMEGA16U2-AU; Price: None; Package: None; Availability: Unavailable; Value: *
U3 U4 = LM1085ISX-5.0/NOPB: 3A Fixed / Adjustable Output Linear Regulator; MF: {'manufacturer': u'Texas Instruments'}; Price: None; Availability: Unavailable; Package: None; MP: LM1085ISX-5.0/NOPB; Value: *
U5 = LM324APWR: MF: {'manufacturer': u'Texas Instruments'}; Value: *; Availability: Unavailable; Price: None; Package: None; MP: LM324APWR
U6 = LP2985-33DBVRE4: MF: {'manufacturer': u'Texas Instruments'}; Price: None; Availability: Unavailable; Package: None; MP: LP2985-33DBVRE4; Value: *
U7 = TMC429-PI24: <b>TRINAMIC 3-axis universal motion controller for stepper motor drivers</b><p>  Information given in this library is believed to be accurate and reliable. However no warranty is given for its correctness.<p>  <a href="http://www.trinamic.com/tmc/media/Downloads/integrated_circuits/TMC429/TMC429_datasheet.pdf">Datasheet for TMC429</a>  <h3>Description</h3><h3>3-axis universal motion controller for stepper motor drivers</h3><p>The TMC429 is a miniaturized low cost, high performance stepper motor controller for up to three motors. It integrates all real time critical tasks in reliable, dedicated hardware: An integrated motion ramp profile generator as well as an adaptable microstep sequencer with microstep RAM table. Advanced stop- and reference switch handling allows for precise and fast referencing as well as on-the-fly position checking. Automatic motor current control gives high motor dynamics while saving energy. The interrupt output can generate precise position pulses. </p><p>The TMC429 is fully downwards compatible to the TMC428.</p><p>The TMC429 connects to the recent coolStep&trade;  drivers (TMC260, TMC262 and TMC389) via Step- &amp; Direction signals (S/D) or to the classic TRINAMIC drivers TMC236, TMC239, TMC246 and TMC249 via SPI&trade; . The communication with the host microcontroller is done with an extra SPI&trade;  interface. The host just needs to do high-level control tasks, e.g. giving the command: Drive motor 2 to position 1000. The TMC429 automatically calculates the motion ramp based on velocity and acceleration parameters.<br></p><h2>TMC 429 - the small but intelligent controller</h2><ul><li>Miniaturized low cost 3 axes motor controller </li><li>High-performance micro stepping </li><li>SPI&trade;  host interface with easy-to-use protocol </li><li>Step-/Direction or SPI&trade;  driver interface </li><li>On-the-fly alteration of position set point </li></ul><h2>Specifications</h2><h3>Main characteristics </h3><ul><li>controls up to three stepper motors </li><li>selectable driver interface: Step&amp;Direction or SPI</li><li>different types of SPI&trade;  stepper motor driver chips may by mixed within a single daisy chain </li><li>communication on demand minimizes traffic to the SPI&trade;  stepper motor drivers chain </li><li>allows read-out of driver status information </li><li>programmable SPI&trade;  data rates up to 1 Mbit/s </li><li>wide range for clock frequency - can use CPU clock up to 32 MHz </li><li>internal 24 bit wide position counters </li><li>full step frequencies up to 20 kHz </li><li>individual micro step resolution of {64, 32, 16, 8, 4, 2, 1} micro steps (SPI mode) </li><li>programmable 6 bit micro step table with up to 64 entries for a quarter sine wave period (SPI mode) </li><li>on-the-fly alteration of target motion parameters (like position, velocity, acceleration) </li><li>read-out facility for current motion parameters (position, velocity, acceleration) </li><li>integrated power-on-reset </li><li>NEW: "position reached" trigger output</li></ul><h3>Interface </h3><ul><li>Configurable interface for SPI&trade;  motor drivers (e.g. TMC236, TMC239, TMC246, TMC249) </li><li>Step-/Direction interface for universal motor drivers (e.g. TMC260, TMC262, TMC389) </li><li>SPI&trade;  host interface </li></ul><h3>Electrical Data </h3><ul><li>3.3V or 5V operation with CMOS / TTL compatible IOs (all inputs Schmitt-Trigger) </li><li>Power down mode (100 ÂµA) with transparent wake-up for normal operation (typ. 10 mA @ 16 MHz) </li></ul><h3>Package </h3><ul><li>Chip size 32 pin QFN 5x5mm</li><li>SOP24</li><li>Ultra small 16 pin SSOP (TMC428-I compatible, reduced TMC429 functionality) </li></ul>; MF: {'manufacturer': u'Trinamic Motion'}; Value: *; MP: TMC429-PI24; Package: None; Price: None; Availability: Unavailable
U8 U9 = TMC2226-SA: MF: {'manufacturer': u'Trinamic Motion Control GmbH'}; Price: None; Package: None; Availability: Unavailable; Value: *; MP: TMC2226-SA
U11 = TXS0102DCUR: MF: {'manufacturer': u'Texas Instruments'}; Value: *; Package: None; MP: TXS0102DCUR; Price: None; Availability: Unavailable
U12 = USB2514BT/M2: USB Hub Controller USB Interface 36-SQFN (6x6); MF: {'manufacturer': u'Microchip'}; Value: *; Package: None; MP: USB2514BT/M2; Price: None; Availability: Unavailable
U13 = PRTR5V0U2F: Clamp Ipp Tvs Diode Surface Mount 6-XSON, SOT886 (1.45x1); MF: {'manufacturer': u'Nexperia USA'}; Package: None; Value: *; Availability: Unavailable; MP: PRTR5V0U2F; Price: None
U14-U17 = SN74LS641-1DW: MF: {'manufacturer': u'Texas Instruments'}; Package: None; Value: *; Availability: Unavailable; MP: SN74LS641-1DW; Price: None
U18 = MAX490CUA: MF: {'manufacturer': u'Maxim Integrated'}; Availability: Unavailable; Price: None; Value: *; MP: MAX490CUA; Package: None
U19 = SN74LVC2GU04DBVT: MF: {'manufacturer': u'Texas Instruments'}; Package: None; MP: SN74LVC2GU04DBVT; Price: None; Availability: Unavailable; Value: *
USB = AU-Y1007: Conn Usb Rtang Female Type b Pcb; MF: {'manufacturer': u'Assmann WSW'}; MP: AU-Y1007; Price: None; Package: None; Value: *; Availability: Unavailable
USBOUT1 USBOUT2 = 1903815-1: Conn USB 2.0 Type A RCP 4/4 POS 2.5mm Solder RA Thru-Hole 8 Terminal 2 Port Tray; MF: {'manufacturer': u'TE Connectivity'}; Availability: Unavailable; Price: None; Value: *; MP: 1903815-1; Package: None
USBPi = 6364372-2: Conn USB 2.0 Type A RCP 4 POS Solder RA Thru-Hole 4 Terminal 1 Port Box/Tube; MF: {'manufacturer': u'TE Connectivity'}; Availability: Unavailable; Price: None; Value: *; MP: 6364372-2; Package: None
Y1 = ABLS-16.000MHZ-20-B-4-Y-T: MF: {'manufacturer': u'Abracon LLC'}; Availability: Unavailable; Package: None; Price: None; MP: ABLS-16.000MHZ-20-B-4-Y-T; Value: *
Y2 = CSTNE16M0V530000R0: 16MHz Ceramic Resonator Built in Capacitor 15pF Â±0.15% 40 Ohms -40Â°C ~ 125Â°C Surface Mount; MF: {'manufacturer': u'Murata Electronics'}; Price: None; MP: CSTNE16M0V530000R0; Availability: Unavailable; Value: *; Package: None
Y3 = ECS-240-18-5PXEN-TR: CRYSTAL SMD; MF: {'manufacturer': u'ECS Inc.'}; Value: *; Package: None; MP: ECS-240-18-5PXEN-TR; Price: None; Availability: Unavailable